# EAGLE schematic Tracker_v3_Robert (EAGLE 9.6.2)
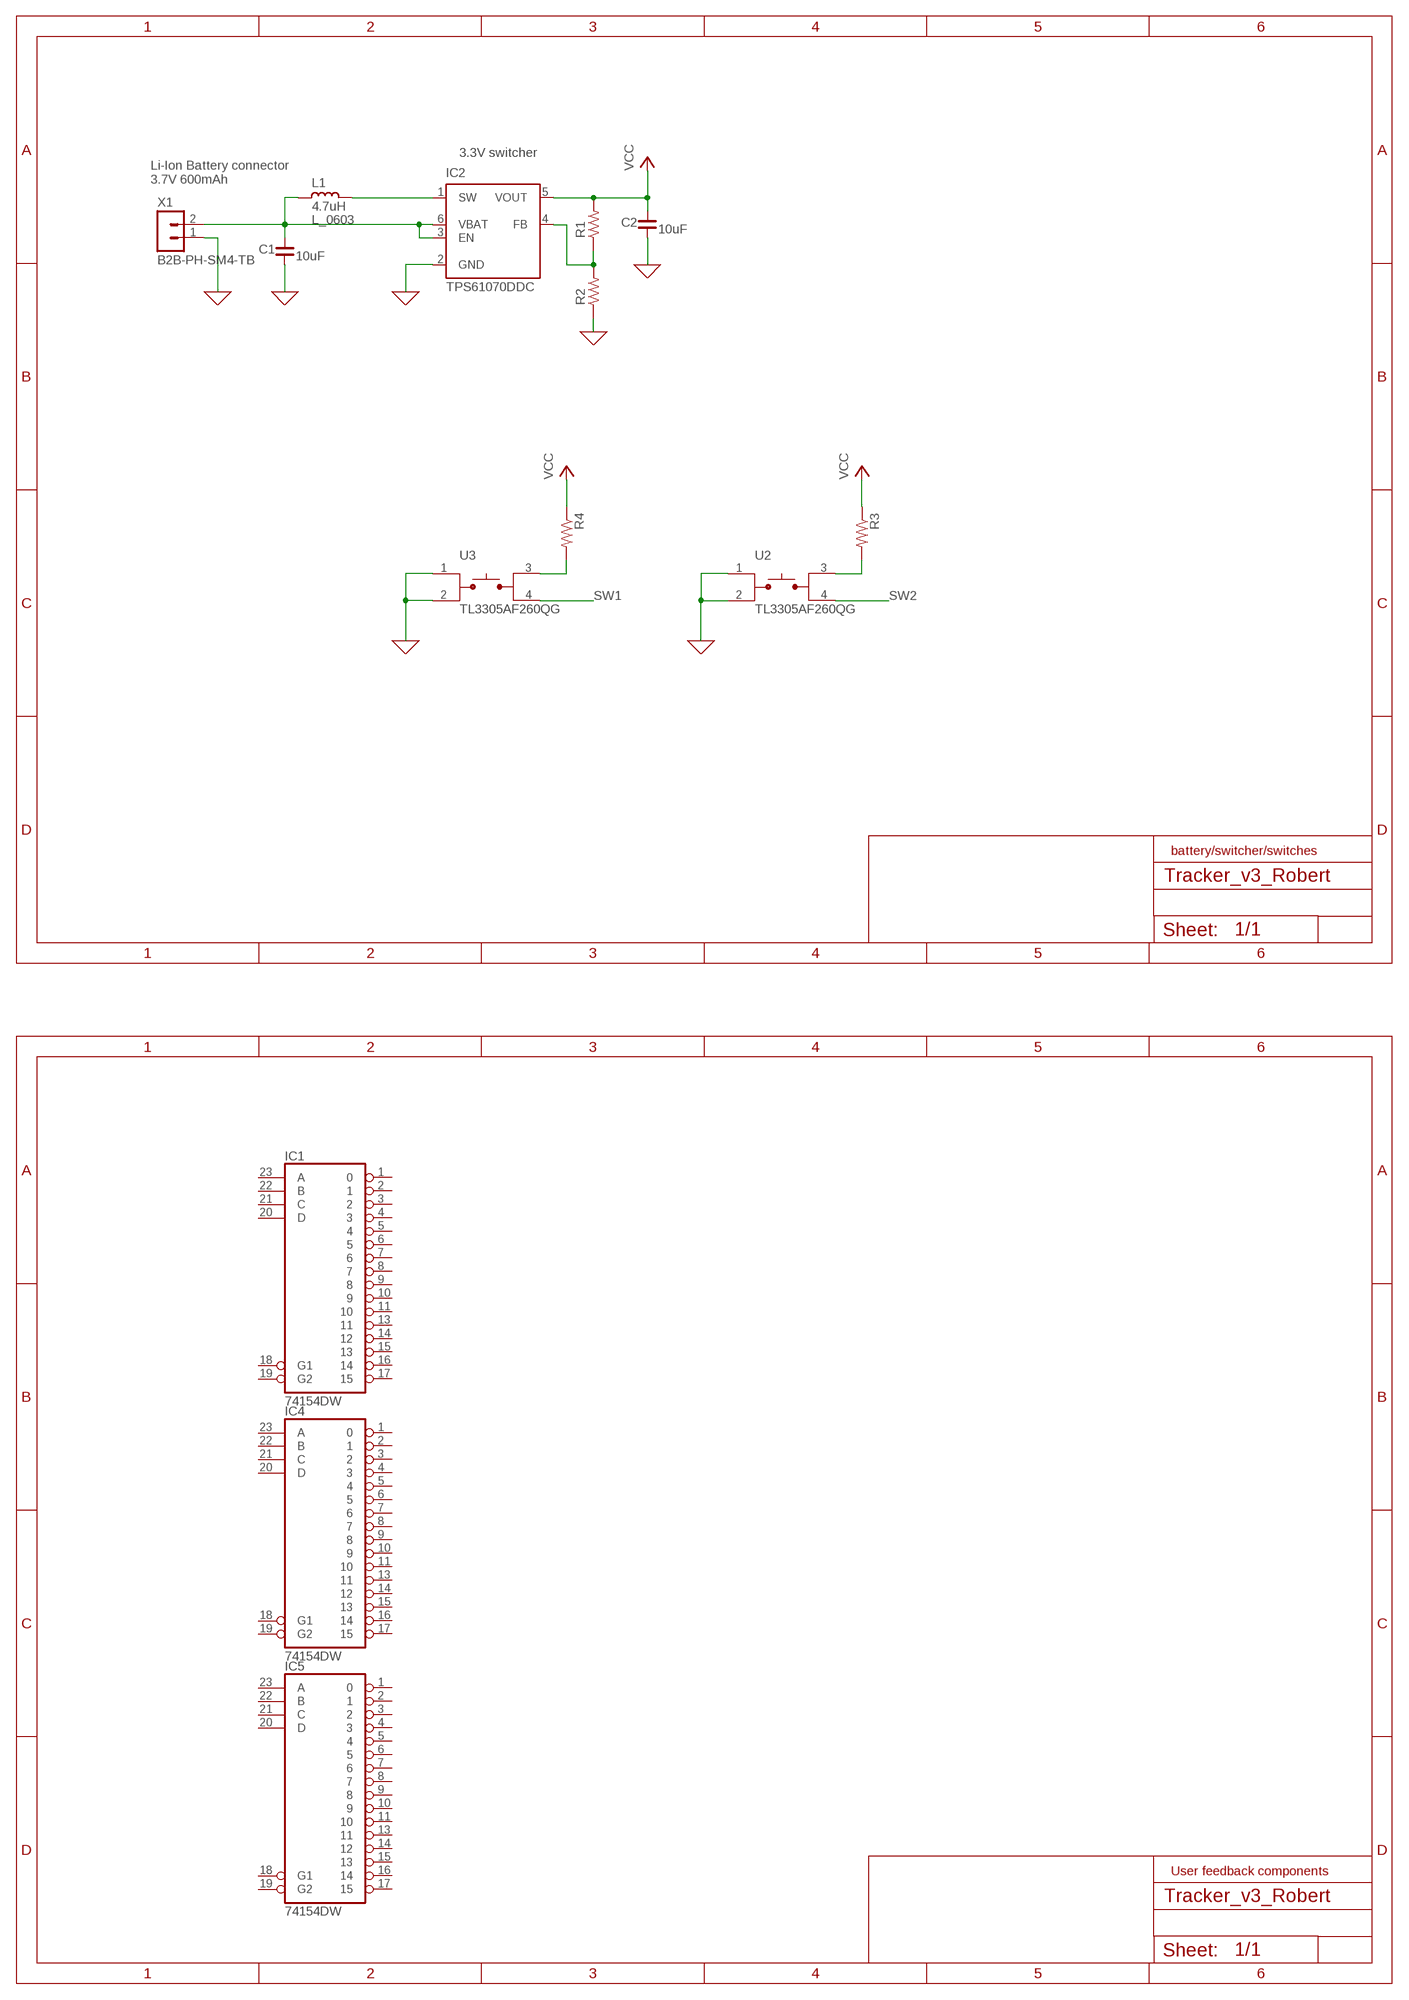
[diagram p0: schematic, sheet 1, part 1 of 2]
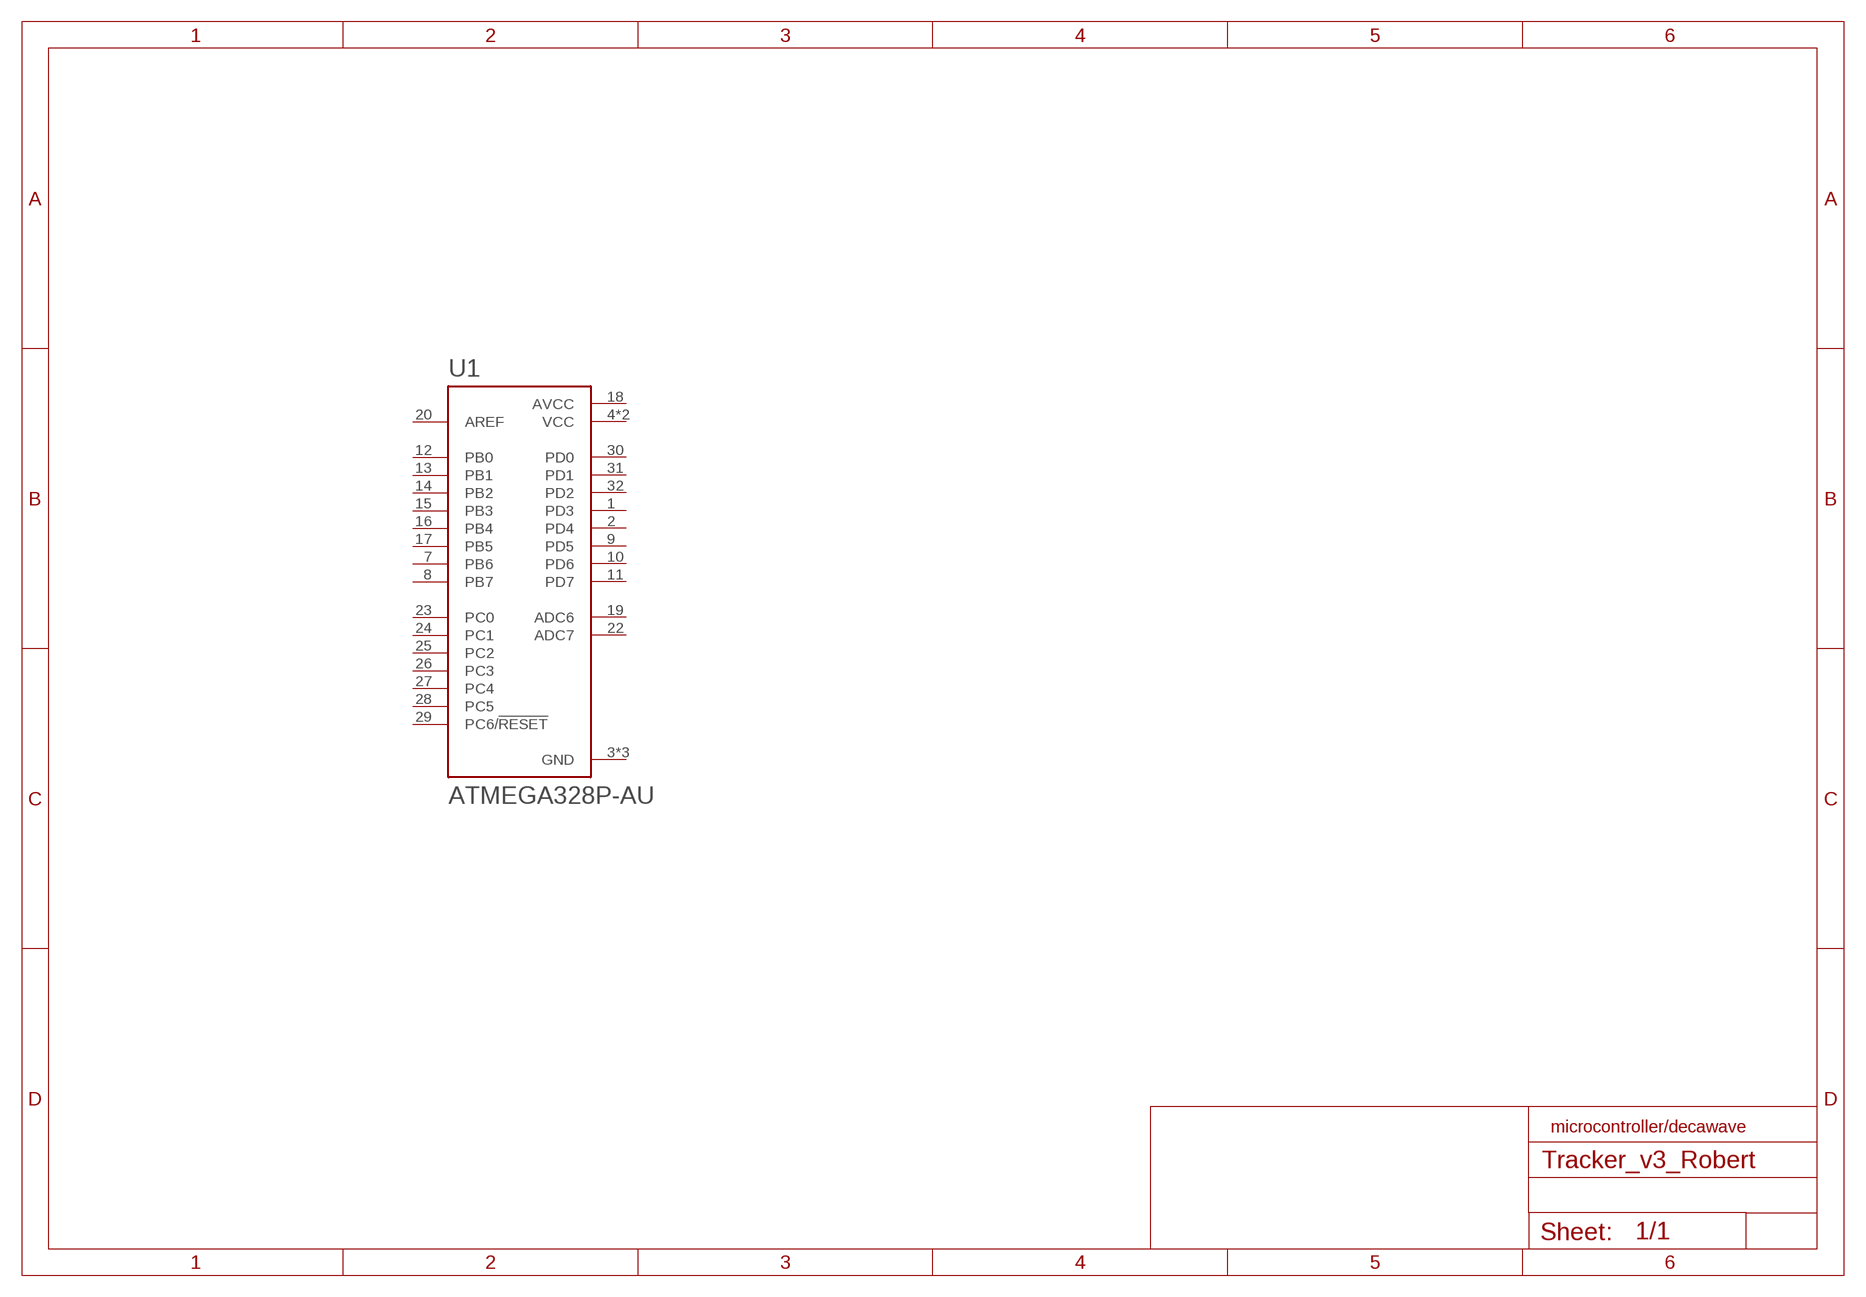
[diagram p1: schematic, sheet 1, part 2 of 2]

## Parts
C1  C_0603  [C0603]
C2  C_0603  [C0603]
IC1  74154DW  [SO24W]
IC2  TPS61070DDC  [TSOT23-6_DDC]
IC4  74154DW  [SO24W]
IC5  74154DW  [SO24W]
L1  L_0603  [L0603]
R1  R_0603  [R0603]
R2  R_0603  [R0603]
R3  R-US_R0603  [R0603]
R4  R-US_R0603  [R0603]
U1  ATMEGA328P-AU  [QFP80P900X900X120-32N]
U2  TL3305AF260QG  [SW_TL3305AF260QG]
U3  TL3305AF260QG  [SW_TL3305AF260QG]
X1  B2B-PH-SM4-TB  [B2B-PH-SM4-TB]

## Nets
0: C1.1 C2.1 IC2.2(GND) R2.1 U2.1 U2.2 U3.1 U3.2 X1.1 ; supply symbol labelled GND
N$1: IC2.1(SW) L1.1
N$2: C1.2 IC2.3(EN) IC2.6(VBAT) L1.2 X1.2
N$3: R4.2 U3.3
N$5: R3.2 U2.3
N$6: IC2.4(FB) R1.1 R2.2
SW1: U3.4
SW2: U2.4
VCC: C2.2 IC2.5(VOUT) R1.2 R3.1 R4.1
Unconnected: IC1.1 IC1.2 IC1.3 IC1.4 IC1.5 IC1.6 IC1.7 IC1.8 IC1.9 IC1.10 IC1.11 IC1.13 IC1.14 IC1.15 IC1.16 IC1.17 IC1.18(G1) IC1.19(G2) IC1.20(D) IC1.21(C) IC1.22(B) IC1.23(A) IC4.1 IC4.2 IC4.3 IC4.4 IC4.5 IC4.6 IC4.7 IC4.8 IC4.9 IC4.10 IC4.11 IC4.13 IC4.14 IC4.15 IC4.16 IC4.17 IC4.18(G1) IC4.19(G2) IC4.20(D) IC4.21(C) IC4.22(B) IC4.23(A) IC5.1 IC5.2 IC5.3 IC5.4 IC5.5 IC5.6 IC5.7 IC5.8 IC5.9 IC5.10 IC5.11 IC5.13 IC5.14 IC5.15 IC5.16 IC5.17 IC5.18(G1) IC5.19(G2) IC5.20(D) IC5.21(C) IC5.22(B) IC5.23(A) U1.1(PD3) U1.2(PD4) U1.7(PB6) U1.8(PB7) U1.9(PD5) U1.10(PD6) U1.11(PD7) U1.12(PB0) U1.13(PB1) U1.14(PB2) U1.15(PB3) U1.16(PB4) U1.17(PB5) U1.19(ADC6) U1.20(AREF) U1.22(ADC7) U1.23(PC0) U1.24(PC1) U1.25(PC2) U1.26(PC3) U1.27(PC4) U1.28(PC5) U1.29(PC6/!RESET) U1.30(PD0) U1.31(PD1) U1.32(PD2)

## Notes on the sheet
- 3.3V switcher
- Li-Ion Battery connector
  3.7V 600mAh
- battery/switcher/switches | microcontroller/decawave
- User feedback components

## Power pins joined to a net without a drawn wire
AVCC: U1.18(AVCC)
GND: IC1.12(GND) IC4.12(GND) IC5.12(GND) U1.3(GND) U1.5(GND) U1.21(GND)
VCC: IC1.24(VCC) IC4.24(VCC) IC5.24(VCC) U1.4(VCC) U1.6(VCC)

## Library data of the parts
C1 C2 = rc-master-smd:C_: NON-POLARIZED CAP; C1: 10uF
IC1 IC4 IC5 = 74xx-us:74*154: 4-line to 16-line data SELECTOR/MULTIPLEXER
IC2 = texas:TPS6107*: 90% EFFICIENT SYNCHRONOUS BOOST CONVERTER WITH 600-mA SWITCH Source: http://focus.ti.com/lit/ds/symlink/tps61070.pdf; MPN: TPS61070DDCR; OC_FARNELL: 1461062; OC_NEWARK: 64M3125
L1 = rc-master-smd:L_: INDUCTOR; L1: 4.7uH
R1 R2 = rc-master-smd:R_: RESISTOR
R3 R4 = resistor:R-US_: RESISTOR, American symbol
U1 = ATMEGA328P-AU:ATMEGA328P-AU: ATmega Series 20 MHz 32 KB Flash 2 KB SRAM 8-Bit Microcontroller - TQFP-32 Check prices <https://pricing.snapeda.com/parts/ATMEGA328P-AU/Microchip%20Technology/view-part?ref=eda>; AVAILABILITY: Good; DESCRIPTION: AVR AVR® ATmega Microcontroller IC 8-Bit 20MHz 32KB (16K x 16) FLASH 32-TQFP (7x7); MF: Microchip Technology; MP: ATMEGA328P-AU; PACKAGE: TQFP-32 Microchip Technology; PRICE: None; PURCHASE-URL: https://pricing.snapeda.com/search/part/ATMEGA328P-AU/?ref=eda
U2 U3 = TL3305AF260QG:TL3305AF260QG: Switch Tactile Spst-No 50ma 12v Check prices <https://pricing.snapeda.com/parts/TL3305AF260QG/E-Switch/view-part?ref=eda>; AVAILABILITY: Warning; DESCRIPTION: Tactile Switch SPST-NO Top Actuated Surface Mount; MF: E-Switch; MP: TL3305AF260QG; PACKAGE: LQFP-48 E-Switch; PRICE: None; PURCHASE-URL: https://pricing.snapeda.com/search/part/TL3305AF260QG/?ref=eda
X1 = con-JST PH:B2B-PH: JST PH series header 2.00mm pitch disconnectable crimp style connectors, vertical (side entry type), 2 pins